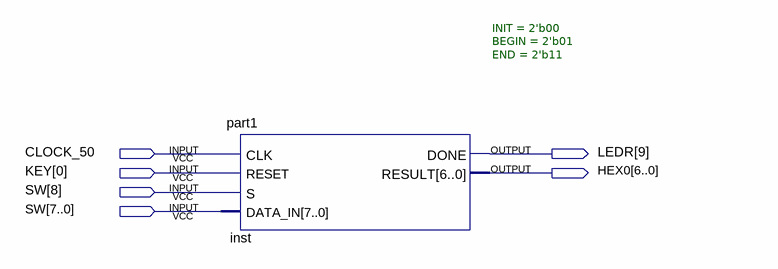
[diagram p0: schematic sheet]
// Quartus schematic Block3.bdf as structural Verilog: 1 symbols, 6 pins
module Block3 (
  input  CLOCK_50,
  input  [0:0] KEY,
  input  [8:0] SW,
  output [9:9] LEDR,
  output [6:0] HEX0
);

  part1 #(.INIT(2'b00), .BEGIN(2'b01), .END(2'b11)) inst (
    .CLK(CLOCK_50), .RESET(KEY[0]), .S(SW[8]), .DATA_IN(SW[7:0]), .DONE(LEDR[9]), .RESULT(HEX0));
endmodule
